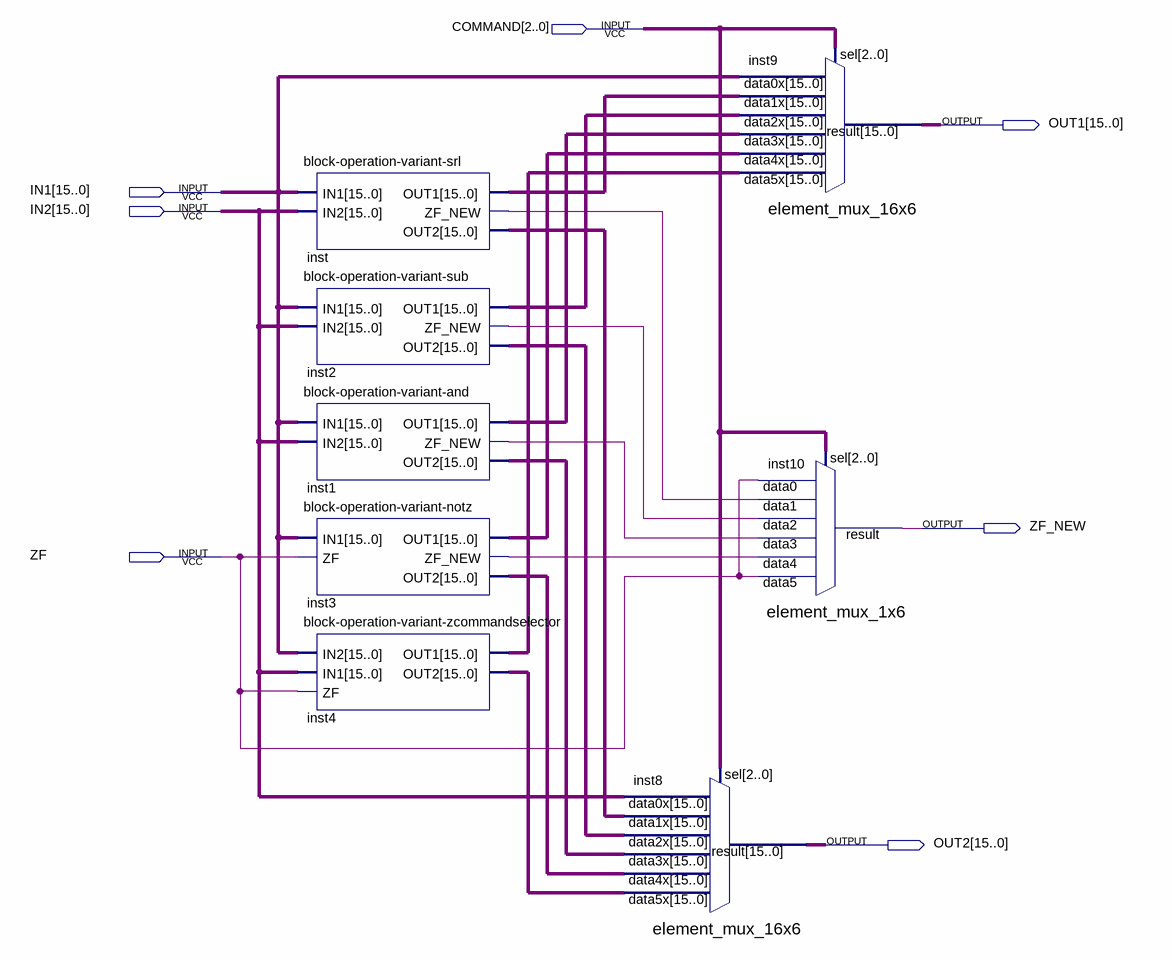
[diagram p0: schematic sheet]
// Quartus schematic block-operation-executor.bdf as structural Verilog: 8 symbols, 7 pins
module \block-operation-executor  (
  input  [2:0] COMMAND,
  input  [15:0] IN1,
  input  [15:0] IN2,
  input  ZF,
  output [15:0] OUT1,
  output ZF_NEW,
  output [15:0] OUT2
);

  wire inst1_zf_new, inst2_zf_new, inst3_zf_new, inst_zf_new;
  wire [15:0] inst1_out1, inst1_out2, inst2_out1, inst2_out2, inst3_out1, inst3_out2, inst4_out1, inst4_out2,
       inst_out1, inst_out2;

  \block-operation-variant-srl  inst (.IN1(IN1), .IN2(IN2), .OUT1(inst_out1), .ZF_NEW(inst_zf_new), .OUT2(inst_out2));
  \block-operation-variant-sub  inst2 (
    .IN1(IN1), .IN2(IN2), .OUT1(inst2_out1), .ZF_NEW(inst2_zf_new), .OUT2(inst2_out2));
  \block-operation-variant-and  inst1 (
    .IN1(IN1), .IN2(IN2), .OUT1(inst1_out1), .ZF_NEW(inst1_zf_new), .OUT2(inst1_out2));
  \block-operation-variant-notz  inst3 (
    .IN1(IN1), .ZF(ZF), .OUT1(inst3_out1), .ZF_NEW(inst3_zf_new), .OUT2(inst3_out2));
  \block-operation-variant-zcommandselector  inst4 (
    .IN2(IN1), .IN1(IN2), .ZF(ZF), .OUT1(inst4_out1), .OUT2(inst4_out2));
  element_mux_16x6 inst8 (
    .data5x(inst4_out2), .data4x(inst3_out2), .data3x(inst1_out2), .data2x(inst2_out2), .data1x(inst_out2),
    .data0x(IN2), .sel(COMMAND), .result(OUT2));
  element_mux_16x6 inst9 (
    .data5x(inst4_out1), .data4x(inst3_out1), .data3x(inst1_out1), .data2x(inst2_out1), .data1x(inst_out1),
    .data0x(IN1), .sel(COMMAND), .result(OUT1));
  element_mux_1x6 inst10 (
    .data5(ZF), .data4(inst3_zf_new), .data3(inst1_zf_new), .data2(inst2_zf_new), .data1(inst_zf_new),
    .data0(ZF), .sel(COMMAND), .result(ZF_NEW));
endmodule
